# EAGLE design M961 (EAGLE 6.6.0)
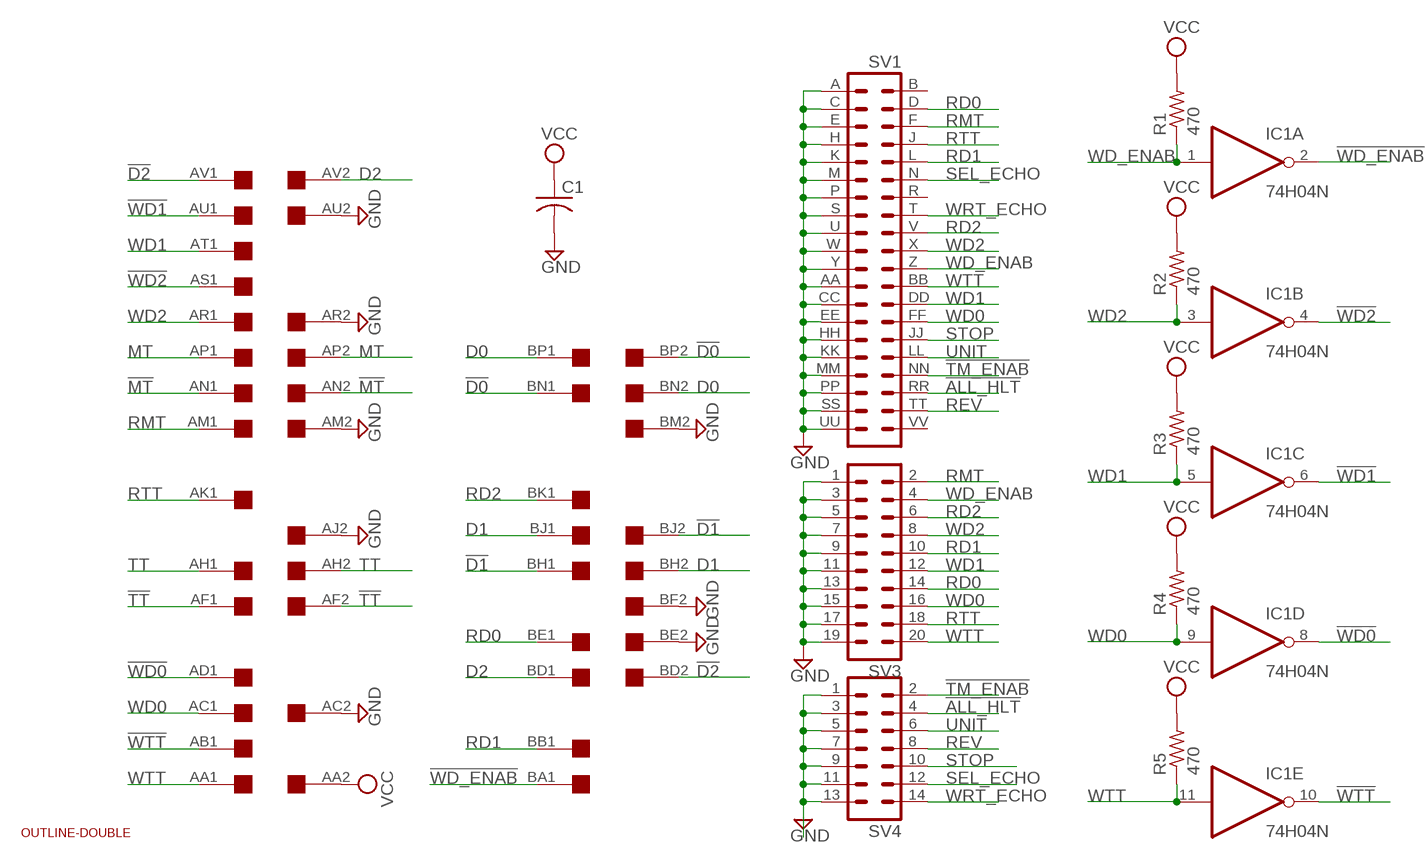
[diagram p0: schematic, sheet 1]

## Parts
C1  C-US050-025X075  [C050-025X075]
EDGE$1  DOUBLE  [EDGE-CON4]
IC1  74H04N  7404N  [DIL14]
R1  470  R-US_0207/10  [0207/10]
R2  470  R-US_0207/10  [0207/10]
R3  470  R-US_0207/10  [0207/10]
R4  470  R-US_0207/10  [0207/10]
R5  470  R-US_0207/10  [0207/10]
SV1  DEC40PINV  [DEC40PINV]
SV3  MA10-2  [MA10-2]
SV4  MA07-2  [MA07-2]
U$2  OUTLINE-DOUBLE  [DOUBLE]

## Nets
!ALL_HLT: SV1.RR SV4.4
!D0: EDGE$1.BN1 EDGE$1.BP2
!D1: EDGE$1.BH1 EDGE$1.BJ2
!D2: EDGE$1.AV1 EDGE$1.BD2
!MT: EDGE$1.AN1 EDGE$1.AN2
!TM_ENAB: SV1.NN SV4.2
!TT: EDGE$1.AF1 EDGE$1.AF2
!WD0: EDGE$1.AD1 IC1.8(D:O)
!WD1: EDGE$1.AU1 IC1.6(C:O)
!WD2: EDGE$1.AS1 IC1.4(B:O)
!WD_ENAB: EDGE$1.BA1 IC1.2(A:O)
!WTT: EDGE$1.AB1 IC1.10(E:O)
D0: EDGE$1.BN2 EDGE$1.BP1
D1: EDGE$1.BH2 EDGE$1.BJ1
D2: EDGE$1.AV2 EDGE$1.BD1
GND: C1.2 EDGE$1.AC2 EDGE$1.AJ2 EDGE$1.AM2 EDGE$1.AR2 EDGE$1.AU2 EDGE$1.BE2 EDGE$1.BF2 EDGE$1.BM2 SV1.A SV1.AA SV1.C SV1.CC SV1.E SV1.EE SV1.H SV1.HH SV1.K SV1.KK SV1.M SV1.MM SV1.P SV1.PP SV1.S SV1.SS SV1.U SV1.UU SV1.W SV1.Y SV3.1 SV3.3 SV3.5 SV3.7 SV3.9 SV3.11 SV3.13 SV3.15 SV3.17 SV3.19 SV4.1 SV4.3 SV4.5 SV4.7 SV4.9 SV4.11 SV4.13
MT: EDGE$1.AP1 EDGE$1.AP2
RD0: EDGE$1.BE1 SV1.D SV3.14
RD1: EDGE$1.BB1 SV1.L SV3.10
RD2: EDGE$1.BK1 SV1.V SV3.6
REV: SV1.TT SV4.8
RMT: EDGE$1.AM1 SV1.F SV3.2
RTT: EDGE$1.AK1 SV1.J SV3.18
SEL_ECHO: SV1.N SV4.12
STOP: SV1.JJ SV4.10
TT: EDGE$1.AH1 EDGE$1.AH2
UNIT: SV1.LL SV4.6
VCC: C1.1 EDGE$1.AA2 R1.2 R2.2 R3.2 R4.2 R5.2
WD0: EDGE$1.AC1 IC1.9(D:I) R4.1 SV1.FF SV3.16
WD1: EDGE$1.AT1 IC1.5(C:I) R3.1 SV1.DD SV3.12
WD2: EDGE$1.AR1 IC1.3(B:I) R2.1 SV1.X SV3.8
WD_ENAB: IC1.1(A:I) R1.1 SV1.Z SV3.4
WRT_ECHO: SV1.T SV4.14
WTT: EDGE$1.AA1 IC1.11(E:I) R5.1 SV1.BB SV3.20
Unconnected: EDGE$1.AB2 EDGE$1.AD2 EDGE$1.AE1 EDGE$1.AE2 EDGE$1.AJ1 EDGE$1.AK2 EDGE$1.AL1 EDGE$1.AL2 EDGE$1.AS2 EDGE$1.AT2 EDGE$1.BA2 EDGE$1.BB2 EDGE$1.BC1 EDGE$1.BC2 EDGE$1.BF1 EDGE$1.BK2 EDGE$1.BL1 EDGE$1.BL2 EDGE$1.BM1 EDGE$1.BR1 EDGE$1.BR2 EDGE$1.BS1 EDGE$1.BS2 EDGE$1.BT1 EDGE$1.BT2 EDGE$1.BU1 EDGE$1.BU2 EDGE$1.BV1 EDGE$1.BV2 IC1.12(F:O) IC1.13(F:I) SV1.B SV1.R SV1.VV

## Power pins joined to a net without a drawn wire
GND: IC1.7(P:GND)
VCC: IC1.14(P:VCC)

## Library data of the parts
C1 = rcl:C-US: CAPACITOR, American symbol
EDGE$1 = dec-con:DOUBLE: Double-Height DEC board
IC1 = 74xx-us:74*04: Hex INVERTER
R1-R5 = rcl:R-US_: RESISTOR, American symbol
SV1 = dec-con:DEC40PIN: PIN HEADER
SV3 = con-lstb:MA10-2: PIN HEADER; OC_FARNELL: unknown; OC_NEWARK: unknown
SV4 = con-lstb:MA07-2: PIN HEADER; OC_FARNELL: unknown; OC_NEWARK: unknown
U$2 = dec-con:OUTLINE-*: Board outlines for DEC boards.

## Board
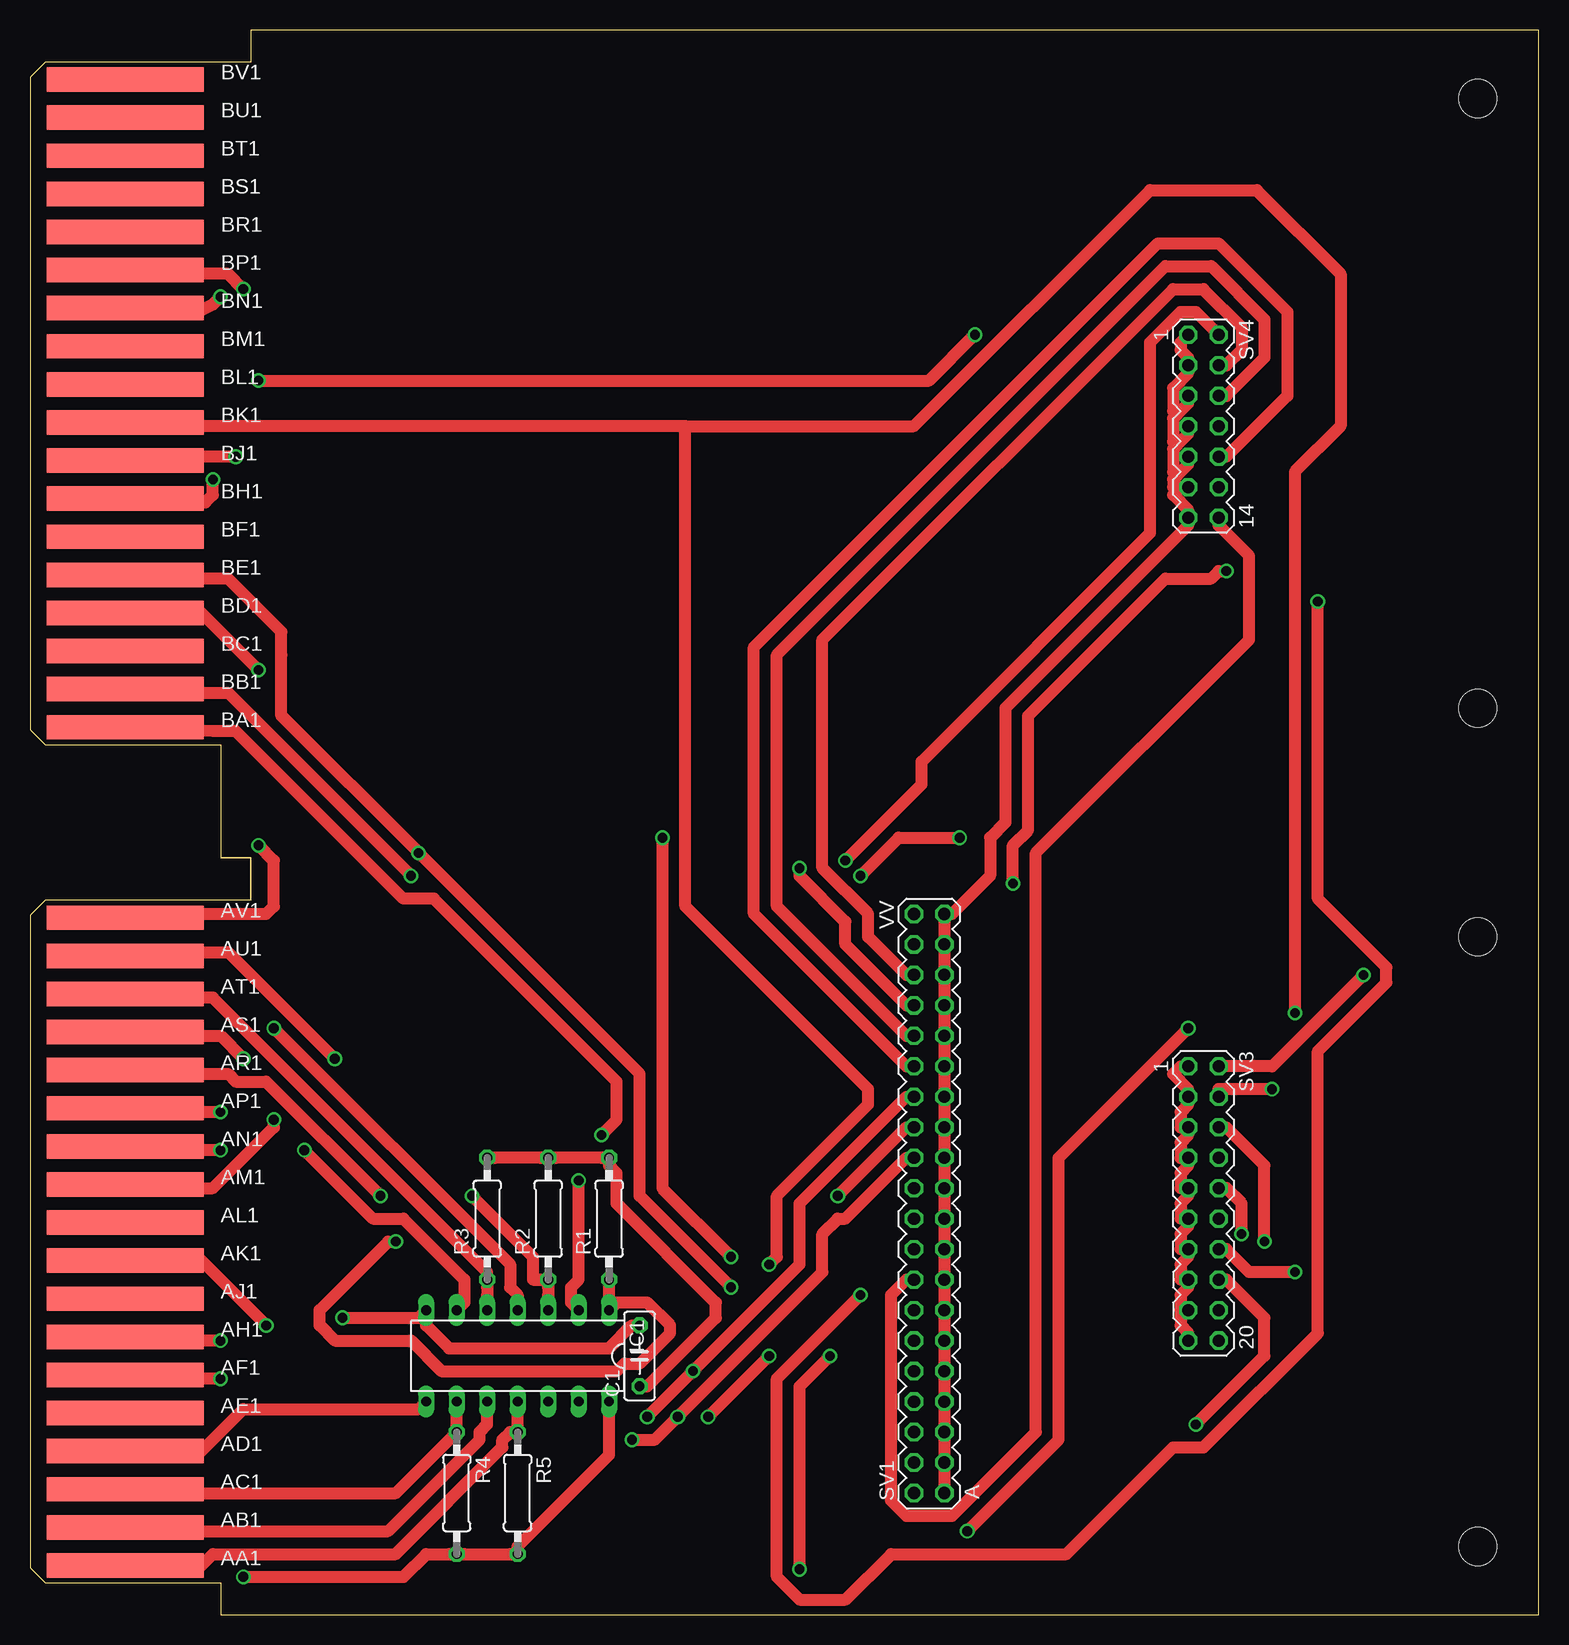
[diagram p1: board, top side]
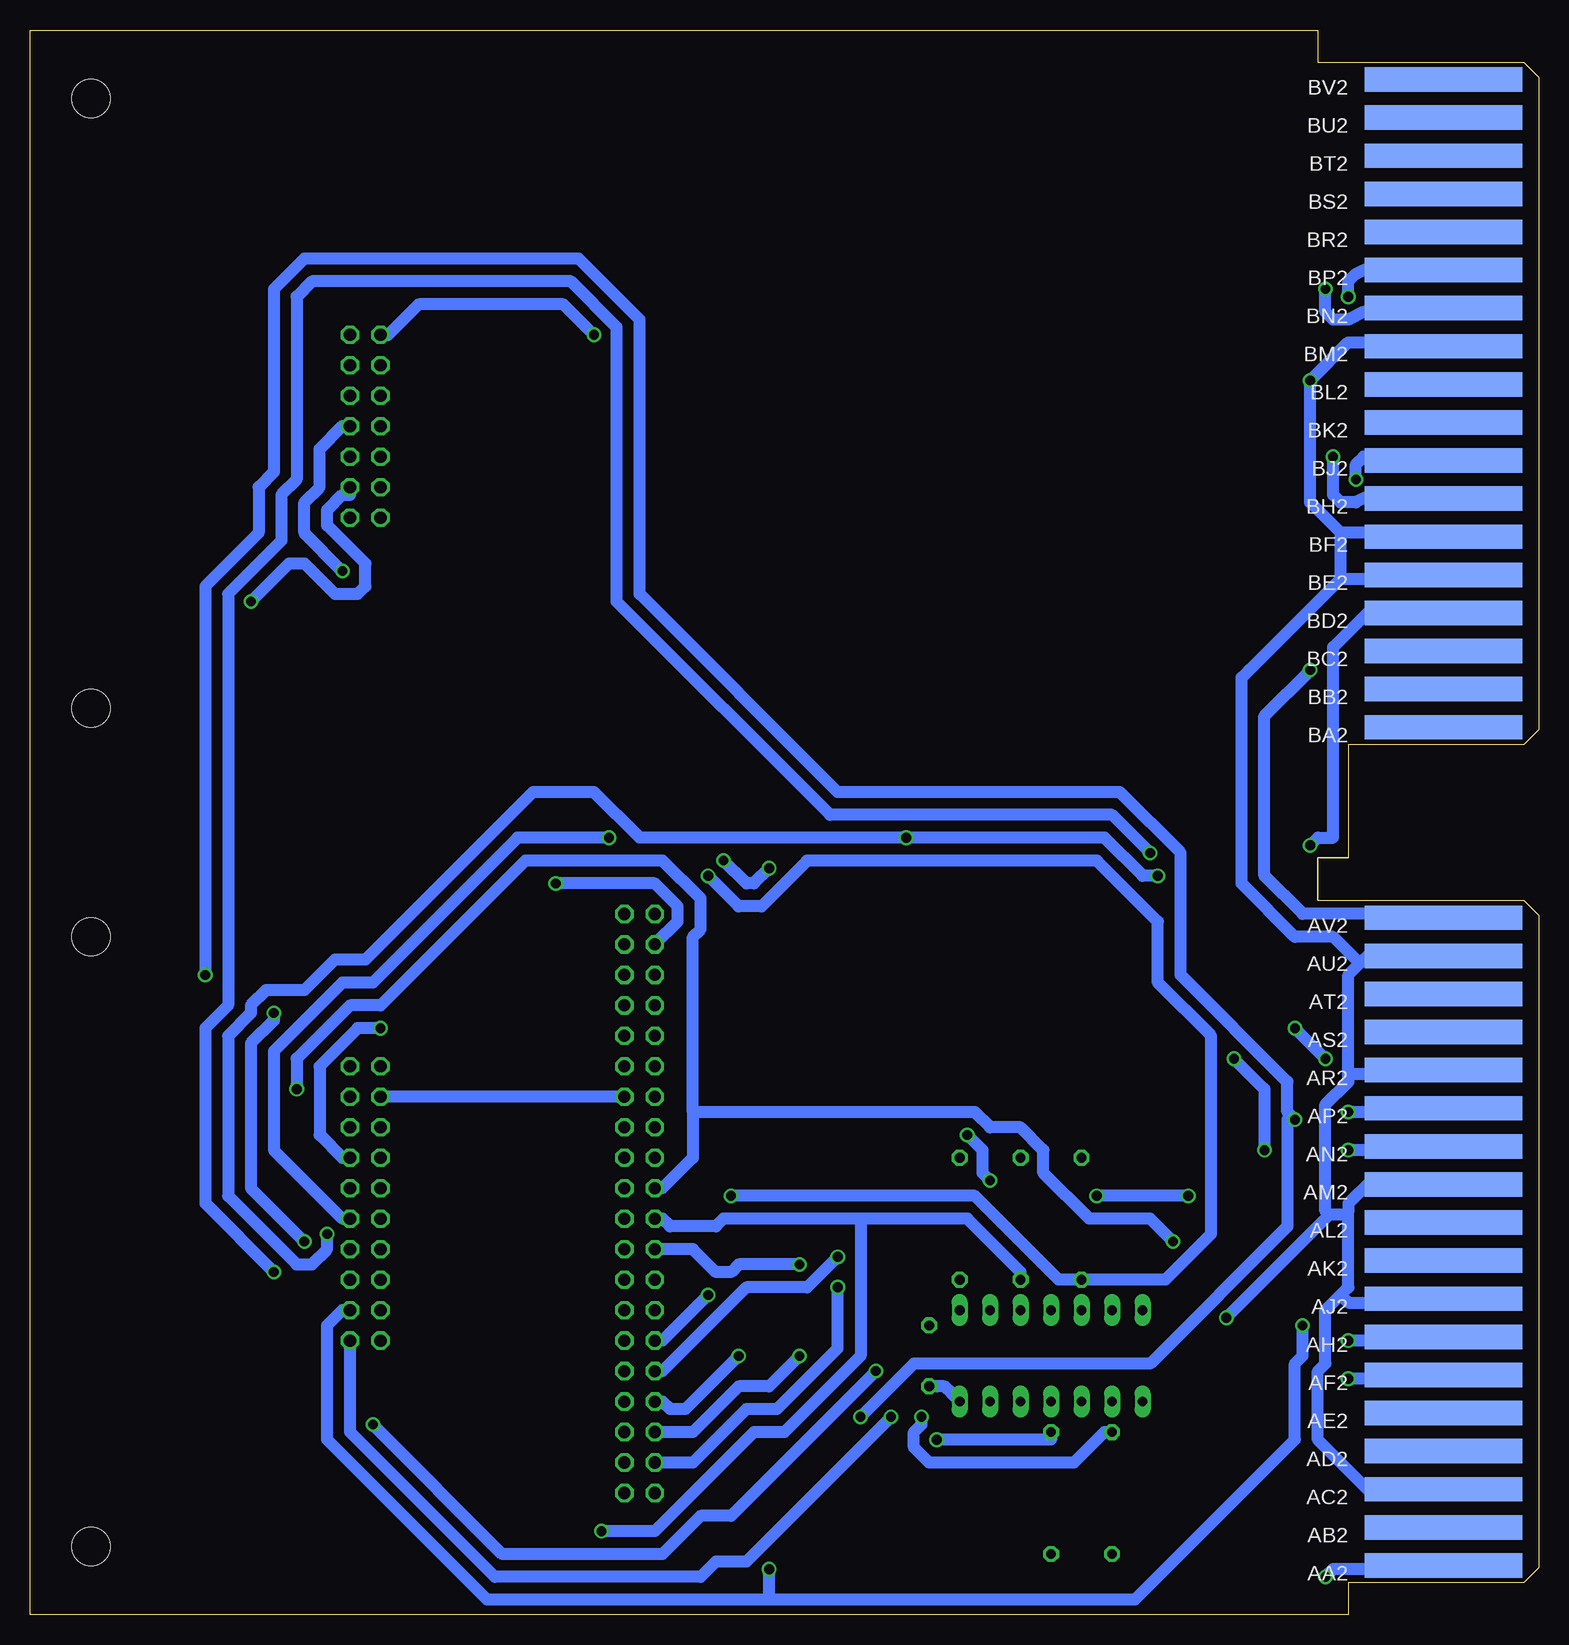
[diagram p2: board, bottom side, seen from below]

Size 125.73 x 132.08 mm. Coordinates in mm from the lower left corner, seen from the top.
Copper layers (1+16): Top 0.035mm / dielectric 1.5mm / Bottom 0.035mm
Design rules "16mils": minimum track width 16mil, minimum drill 32mil, track to track 15mil, track to pad 10mil, pad to pad 10mil, via to via 10mil, smd to smd 10mil, copper to edge 13mil, drill to drill 10mil, minimum pad ring 10mil, minimum via ring 8mil, stop-mask expansion 0mil, vias tented up to drill 0mil, thermal gap 10mil

### Footprints (pad centres in the part's own frame; a part is rotated, then mirrored left to right if it is on the bottom)
C050-025X075 = drill 0.813 octagon: 1 -2.54,0; 2 2.54,0
EDGE-CON4 = smd 13.106 x 2.032: AA1 7.938,4.128; AB1 7.938,7.303; AC1 7.938,10.477; AD1 7.938,13.652; AE1 7.938,16.828; AF1 7.938,20.003; AH1 7.938,23.177; AJ1 7.938,26.352; AK1 7.938,29.527; AL1 7.938,32.703; AM1 7.938,35.877; AN1 7.938,39.053; AP1 7.938,42.227; AR1 7.938,45.403; AS1 7.938,48.578; AT1 7.938,51.752; AU1 7.938,54.928; AV1 7.938,58.102; BA1 7.938,73.978; BB1 7.938,77.153; BC1 7.938,80.328; BD1 7.938,83.502; BE1 7.938,86.677; BF1 7.938,89.853; BH1 7.938,93.028; BJ1 7.938,96.203; BK1 7.938,99.377; BL1 7.938,102.552; BM1 7.938,105.728; BN1 7.938,108.903; BP1 7.938,112.078; BR1 7.938,115.252; BS1 7.938,118.427; BT1 7.938,121.603; BU1 7.938,124.778; BV1 7.938,127.953 | smd 13.106 x 2.032 bottom: AA2 7.938,4.128; AB2 7.938,7.303; AC2 7.938,10.477; AD2 7.938,13.652; AE2 7.938,16.828; AF2 7.938,20.003; AH2 7.938,23.177; AJ2 7.938,26.352; AK2 7.938,29.527; AL2 7.938,32.703; AM2 7.938,35.877; AN2 7.938,39.053; AP2 7.938,42.227; AR2 7.938,45.403; AS2 7.938,48.578; AT2 7.938,51.752; AU2 7.938,54.928; AV2 7.938,58.102; BA2 7.938,73.978; BB2 7.938,77.153; BC2 7.938,80.328; BD2 7.938,83.502; BE2 7.938,86.677; BF2 7.938,89.853; BH2 7.938,93.028; BJ2 7.938,96.203; BK2 7.938,99.377; BL2 7.938,102.552; BM2 7.938,105.728; BN2 7.938,108.903; BP2 7.938,112.078; BR2 7.938,115.252; BS2 7.938,118.427; BT2 7.938,121.603; BU2 7.938,124.778; BV2 7.938,127.953
DIL14 = drill 0.813 long: 1 -7.62,-3.81; 2 -5.08,-3.81; 3 -2.54,-3.81; 4 0,-3.81; 5 2.54,-3.81; 6 5.08,-3.81; 7 7.62,-3.81; 8 7.62,3.81; 9 5.08,3.81; 10 2.54,3.81; 11 0,3.81; 12 -2.54,3.81; 13 -5.08,3.81; 14 -7.62,3.81
0207/10 = drill 0.813 octagon: 1 -5.08,0; 2 5.08,0
DEC40PINV = drill 1.016 octagon: A -24.13,-1.27; AA 3.81,-1.27; B -24.13,1.27; BB 3.81,1.27; C -21.59,-1.27; CC 6.35,-1.27; D -21.59,1.27; DD 6.35,1.27; E -19.05,-1.27; EE 8.89,-1.27; F -19.05,1.27; FF 8.89,1.27; H -16.51,-1.27; HH 11.43,-1.27; J -16.51,1.27; JJ 11.43,1.27; K -13.97,-1.27; KK 13.97,-1.27; L -13.97,1.27; LL 13.97,1.27; M -11.43,-1.27; MM 16.51,-1.27; N -11.43,1.27; NN 16.51,1.27; P -8.89,-1.27; PP 19.05,-1.27; R -8.89,1.27; RR 19.05,1.27; S -6.35,-1.27; SS 21.59,-1.27; T -6.35,1.27; TT 21.59,1.27; U -3.81,-1.27; UU 24.13,-1.27; V -3.81,1.27; VV 24.13,1.27; W -1.27,-1.27; X -1.27,1.27; Y 1.27,-1.27; Z 1.27,1.27
MA10-2 = drill 1.016 octagon: 1 -11.43,-1.27; 2 -11.43,1.27; 3 -8.89,-1.27; 4 -8.89,1.27; 5 -6.35,-1.27; 6 -6.35,1.27; 7 -3.81,-1.27; 8 -3.81,1.27; 9 -1.27,-1.27; 10 -1.27,1.27; 11 1.27,-1.27; 12 1.27,1.27; 13 3.81,-1.27; 14 3.81,1.27; 15 6.35,-1.27; 16 6.35,1.27; 17 8.89,-1.27; 18 8.89,1.27; 19 11.43,-1.27; 20 11.43,1.27
MA07-2 = drill 1.016 octagon: 1 -7.62,-1.27; 2 -7.62,1.27; 3 -5.08,-1.27; 4 -5.08,1.27; 5 -2.54,-1.27; 6 -2.54,1.27; 7 0,-1.27; 8 0,1.27; 9 2.54,-1.27; 10 2.54,1.27; 11 5.08,-1.27; 12 5.08,1.27; 13 7.62,-1.27; 14 7.62,1.27
DOUBLE = hole 3.175: 120.65,56.515; 120.65,5.715; 120.65,75.565; 120.65,126.365

### Placement (x,y rotation side)
C1  50.8,21.59 90 top
EDGE$1  0,0 0 top
IC1  40.64,21.59 180 top
R1  48.26,33.02 90 top
R2  43.18,33.02 90 top
R3  38.1,33.02 90 top
R4  35.56,10.16 270 top
R5  40.64,10.16 270 top
SV1  74.93,34.29 90 top
SV3  97.79,34.29 270 top
SV4  97.79,99.06 270 top
U$2  0,0 0 top

### Tracks (layer width: path | path; a pad name or v marks a point on that pad's centre or on a via)
!ALL_HLT
  Top 1.016: SV1.RR 73.03,53.34 69.85,56.52 69.85,58.42 66.04,62.23 66.04,81.28 95.25,110.49 97.79,110.49 100.97,107.31 100.97,105.41 99.7,104.14 SV4.4
!D0  (via drill 0.81)
  Top 1.016: v15.88,109.86 15.24,109.22 13.97,108.58 EDGE$1.BN1
  Bottom 1.016: v15.88,109.86 15.88,111.12 15.24,111.76 13.97,112.39 EDGE$1.BP2
!D1  (via drill 0.81)
  Top 1.016: v15.24,94.61 15.24,93.34 14.61,92.71 13.97,92.71 EDGE$1.BH1
  Bottom 1.016: v15.24,94.61 15.24,95.89 14.61,96.52 13.97,96.52 EDGE$1.BJ2
!D2  (via drill 0.81)
  Top 1.016: v19.05,64.14 20.32,62.87 20.32,59.05 19.69,58.42 13.97,58.42 EDGE$1.AV1
  Bottom 1.016: v19.05,64.14 18.42,64.77 17.15,64.77 17.15,80.64 13.97,83.82 EDGE$1.BD2
!MT  (via drill 0.81)
  Top 1.016: v15.88,38.73 13.97,38.73 EDGE$1.AN2
  Bottom 1.016: v15.88,38.73 13.97,38.73 EDGE$1.AN2
!TM_ENAB  (via drill 0.81)
  Top 1.016: v64.14,62.23 64.14,61.59 67.95,57.78 67.95,55.88 73.03,50.8 SV1.NN | v67.95,62.87 74.3,69.22 74.3,71.12 93.35,90.17 93.35,106.05 95.89,108.58 97.16,108.58 SV4.2
  Bottom 1.016: v64.14,62.23 65.41,60.96 66.04,60.96 v67.95,62.87
!TT  (via drill 0.81)
  Top 1.016: v15.88,19.68 13.97,19.68 EDGE$1.AF2
  Bottom 1.016: v15.88,19.68 13.97,19.68 EDGE$1.AF2
!WD0
  Top 1.016: IC1.8 32.39,17.14 17.78,17.14 13.97,13.34 EDGE$1.AD1
!WD1  (via drill 0.81)
  Top 1.016: v25.4,46.35 16.51,55.24 13.97,55.24 EDGE$1.AU1 | v22.86,38.73 28.58,33.02 31.12,33.02 36.2,27.94 36.2,26.04 IC1.6
  Bottom 1.016: v25.4,46.35 22.86,43.81 v22.86,38.73
!WD2  (via drill 0.81)
  Top 1.016: v20.32,48.9 40.01,29.21 40.01,27.3 40.64,26.67 IC1.4 | v17.78,46.35 15.88,48.26 13.97,48.26 EDGE$1.AS1
  Bottom 1.016: v17.78,46.35 v20.32,48.9
!WD_ENAB  (via drill 0.81)
  Top 1.016: v47.63,40.01 48.9,41.27 48.9,44.45 33.66,59.69 31.12,59.69 17.15,73.66 15.24,73.66 EDGE$1.BA1 | v45.72,36.2 45.72,27.94 45.09,27.3 45.09,26.04 IC1.2
  Bottom 1.016: v47.63,40.01 46.36,38.73 46.36,36.83 v45.72,36.2
!WTT
  Top 1.016: IC1.10 38.1,15.88 37.47,15.24 37.47,14.61 29.85,6.99 12.7,6.99 EDGE$1.AB1
D0  (via drill 0.81)
  Top 1.016: v17.78,110.49 16.51,111.76 13.97,111.76 EDGE$1.BP1
  Bottom 1.016: v17.78,110.49 17.78,108.58 17.15,107.95 15.88,107.95 14.61,108.58 13.97,108.58 EDGE$1.BN2
D1  (via drill 0.81)
  Top 1.016: v17.15,96.52 13.97,96.52 EDGE$1.BJ1
  Bottom 1.016: v17.15,96.52 17.15,93.34 16.51,92.71 15.24,92.71 13.97,93.34 EDGE$1.BH2
D2  (via drill 0.81)
  Top 1.016: v19.05,78.74 13.97,83.82 EDGE$1.BD1
  Bottom 1.016: v19.05,78.74 22.86,74.93 22.86,61.59 19.69,58.42 13.97,58.42 EDGE$1.AV2
GND  (via drill 0.81)
  Top 1.016: SV3.1 95.89,45.72 95.25,45.09 96.52,43.81 SV3.3 96.52,42.55 95.89,41.91 95.89,40.64 SV3.5 96.52,40.01 95.89,39.37 95.89,38.1 SV3.7 96.52,37.47 95.89,36.83 95.89,35.56 SV3.9 96.52,34.92 95.89,34.29 95.89,33.02 SV3.11 96.52,32.38 95.89,31.75 95.89,30.48 SV3.13 96.52,29.84 95.89,29.21 95.89,27.94 SV3.15 96.52,27.3 95.89,26.67 95.89,25.4 | 95.89,25.4 95.89,24.13 96.52,23.5 SV3.19 | 95.89,25.4 SV3.17 | SV4.1 95.89,106.05 95.89,105.41 96.52,104.78 SV4.3 96.52,103.5 95.25,102.23 95.25,100.33 95.57,100.01 | 95.57,93.66 95.89,93.98 SV4.11 | 95.57,93.66 95.25,93.34 96.52,92.08 SV4.13 96.52,90.81 81.28,75.56 81.28,66.04 80.01,64.77 80.01,61.59 76.84,58.42 SV1.UU SV1.SS SV1.PP SV1.MM SV1.KK SV1.HH SV1.EE SV1.CC SV1.AA SV1.Y SV1.W SV1.U SV1.S SV1.P SV1.M SV1.K SV1.H SV1.E SV1.C SV1.A | 95.57,94.93 95.25,94.61 95.25,93.98 95.57,93.66 | 95.57,94.93 96.52,95.89 SV4.9 | 95.57,97.47 95.25,97.16 95.25,95.25 95.57,94.93 | 95.57,97.47 96.52,98.42 SV4.7 | 95.57,100.01 95.25,99.69 95.25,97.79 95.57,97.47 | 95.57,100.01 96.52,100.97 SV4.5 | C1.2 50.17,24.13 48.26,22.23 34.93,22.23 33.02,24.13 IC1.7 32.39,24.77 v26.04,24.77 | v78.74,106.68 74.93,102.87 v19.05,102.87
  Bottom 0.406: 15.88,45.09 15.88,44.45
  Bottom 1.016: SV1.EE SV3.3 | 16.51,86.36 16.51,90.17 | 16.51,90.17 19.05,92.71 v19.05,102.87 15.88,106.05 13.97,106.05 EDGE$1.BM2 | 16.51,90.17 13.97,90.17 EDGE$1.BF2 | 15.88,45.09 13.97,45.09 EDGE$1.AR2 | 14.92,54.29 13.97,55.24 EDGE$1.AU2 | 14.92,54.29 15.88,53.34 15.88,44.45 17.78,42.55 17.78,33.66 17.46,33.34 | 16.51,26.67 15.88,27.3 15.88,33.66 | 16.51,26.67 15.88,26.04 13.97,26.04 EDGE$1.AJ2 | EDGE$1.AM2 13.97,36.2 15.88,34.29 15.88,33.66 | 15.88,33.66 16.19,33.34 17.46,33.34 | 17.46,33.34 v26.04,24.77 | 16.51,26.67 17.78,25.4 17.78,20.95 18.42,20.32 18.42,14.61 13.97,10.16 12.7,10.16 EDGE$1.AC2 | 16.51,86.36 13.97,86.36 12.7,86.36 EDGE$1.BE2 | 16.51,86.36 24.13,78.74 24.77,78.11 24.77,77.47 24.77,60.96 20.32,56.52 17.15,56.52 14.92,54.29 | v78.74,106.68 81.28,109.22 93.35,109.22 95.89,106.68 SV4.1
MT  (via drill 0.81)
  Top 1.016: v15.88,41.91 13.97,41.91 EDGE$1.AP2
  Bottom 1.016: v15.88,41.91 13.97,41.91 EDGE$1.AP2
RD0  (via drill 0.81)
  Top 1.016: v58.42,27.3 50.8,34.92 50.8,45.09 v32.39,63.5 20.96,74.93 20.96,80.01 20.96,81.92 19.05,83.82 16.51,86.36 13.97,86.36 EDGE$1.BE1 | v105.41,28.57 101.6,28.57 99.7,30.48 SV3.14
  Bottom 1.016: SV1.D 70.49,12.7 66.04,17.14 63.5,17.14 58.42,22.23 v58.42,27.3 | v105.41,28.57 111.13,34.29 111.13,48.9 109.22,50.8 109.22,85.09 104.78,89.53 104.78,93.34 103.51,94.61 103.51,109.86 102.24,111.12 80.65,111.12 76.84,107.31 76.84,84.45 59.06,66.67 35.56,66.67 v32.39,63.5
RD1  (via drill 0.81)
  Top 1.016: v31.75,61.59 16.51,76.83 13.97,76.83 EDGE$1.BB1 | v100.97,31.75 100.97,34.29 99.7,35.56 SV3.10 | v58.42,29.84 52.71,35.56 v52.71,64.77
  Bottom 1.016: v31.75,61.59 33.02,61.59 36.2,64.77 v52.71,64.77 74.93,64.77 78.74,68.58 83.82,68.58 97.79,54.61 100.33,54.61 102.87,52.07 106.05,52.07 107.32,50.8 107.32,50.16 109.22,48.26 109.22,34.92 103.51,29.21 102.24,29.21 100.97,30.48 v100.97,31.75 | v58.42,29.84 60.96,27.3 66.04,27.3 73.03,20.32 SV1.L
RD2  (via drill 0.81)
  Top 1.016: 54.61,99.06 73.66,99.06 93.35,118.75 102.24,118.75 109.22,111.76 109.22,99.06 105.41,95.25 v105.41,50.16 | 54.61,99.06 13.97,99.06 EDGE$1.BK1 | v102.87,31.11 102.87,37.47 99.7,40.64 SV3.6 | v61.6,29.21 62.23,29.84 62.23,34.92 69.85,42.55 69.85,43.81 54.61,59.05 54.61,99.06
  Bottom 1.016: v105.41,50.16 105.41,49.53 107.32,47.62 107.32,35.56 v102.87,31.11 | SV1.V 70.49,30.48 68.58,28.57 67.31,28.57 66.68,29.21 v61.6,29.21
REV  (via drill 0.81)
  Top 1.016: v99.7,87 99.06,87 98.43,86.36 94.62,86.36 83.19,74.93 83.19,65.41 81.92,64.14 v81.92,60.96
  Bottom 1.016: v99.7,87 102.87,90.17 102.87,92.71 101.6,93.98 101.6,97.16 99.7,99.06 SV4.8 | v81.92,60.96 73.66,60.96 71.76,59.05 71.76,57.78 SV1.TT
RMT  (via drill 0.81)
  Top 1.016: v20.32,41.27 20.32,40.64 15.24,35.56 13.97,35.56 EDGE$1.AM1 | v111.13,53.34 103.51,45.72 SV3.2 | v56.52,16.51 v61.6,21.59
  Bottom 1.016: 20.64,41.59 20.96,41.91 20.96,44.45 29.85,53.34 29.85,63.5 34.93,68.58 58.42,68.58 74.93,85.09 74.93,107.95 80.01,113.03 102.87,113.03 105.41,110.49 105.41,95.25 106.68,93.98 106.68,90.17 111.13,85.72 v111.13,53.34 | v20.32,41.27 20.64,41.59 | SV1.F 70.49,15.24 66.68,19.05 64.14,19.05 v61.6,21.59 | v56.52,16.51 52.07,20.95 32.39,20.95 20.96,32.38 20.96,41.27 20.64,41.59
RTT  (via drill 0.81)
  Top 1.016: v19.69,24.13 13.97,29.84 12.7,29.84 EDGE$1.AK1 | v66.68,21.59 64.14,19.05 v64.14,3.81
  Bottom 1.016: v19.69,24.13 19.69,21.59 20.32,20.95 20.32,14.61 33.66,1.27 64.14,1.27 | 64.14,1.27 87.63,1.27 100.97,14.61 100.97,24.13 99.7,25.4 SV3.18 | v66.68,21.59 71.12,17.14 72.39,17.14 73.03,17.78 SV1.J | 64.14,1.27 v64.14,3.81
SEL_ECHO  (via drill 0.81)
  Top 1.016: v107.32,84.45 107.32,59.69 113.03,53.98 113.03,52.7 107.32,46.99 107.32,23.5 97.79,13.97 95.25,13.97 86.36,5.08 71.76,5.08 67.95,1.27 64.14,1.27 62.23,3.17 62.23,19.68 v69.22,26.67
  Bottom 1.016: v107.32,84.45 104.14,87.63 102.87,87.63 100.33,85.09 98.43,85.09 97.79,85.72 97.79,87.63 100.97,90.81 100.97,92.08 99.7,93.34 99.06,93.34 SV4.12 | v69.22,26.67 73.03,22.86 SV1.N
STOP
  Top 1.016: SV1.JJ 73.03,45.72 60.33,58.42 60.33,80.64 93.98,114.3 99.06,114.3 104.78,108.58 104.78,101.6 99.7,96.52 SV4.10
TT  (via drill 0.81)
  Top 1.016: v15.88,22.86 13.97,22.86 EDGE$1.AH2
  Bottom 1.016: v15.88,22.86 13.97,22.86 EDGE$1.AH2
UNIT
  Top 1.016: SV1.LL 73.03,48.26 62.23,59.05 62.23,80.01 94.62,112.39 98.43,112.39 102.87,107.95 102.87,104.78 99.7,101.6 SV4.6
VCC  (via drill 0.81)
  Top 1.016: R3.2 38.74,38.1 42.55,38.1 R2.2 43.82,38.1 47.63,38.1 R1.2 48.26,37.47 48.9,36.83 48.9,34.29 57.15,26.04 57.15,24.77 51.44,19.05 C1.1 | v17.78,3.17 31.12,3.17 33.02,5.08 34.93,5.08 R4.2 36.2,5.08 40.01,5.08 R5.2 40.64,5.71 48.26,13.34 48.26,16.51 IC1.14
  Bottom 1.016: IC1.14 48.9,18.41 49.53,19.05 50.17,19.05 C1.1 | v17.78,3.17 17.15,3.81 13.97,3.81 EDGE$1.AA2
WD0  (via drill 0.81)
  Top 1.016: EDGE$1.AC1 13.97,10.16 30.48,10.16 R4.1 35.56,15.88 35.56,16.51 IC1.9 | v51.44,16.51 v55.25,20.32 64.14,29.21 64.14,34.29 73.03,43.18 SV1.FF | v97.16,15.88 102.87,21.59 102.87,24.77 99.7,27.94 SV3.16
  Bottom 1.016: v51.44,16.51 51.44,15.88 52.07,15.24 52.07,13.97 50.8,12.7 38.74,12.7 36.2,15.24 R4.1 | v97.16,15.88 86.36,5.08 73.03,5.08 69.85,8.26 67.31,8.26 v55.25,20.32
WD1  (via drill 0.81)
  Top 1.016: EDGE$1.AT1 13.97,51.44 15.24,51.44 38.1,28.57 R3.1 38.1,27.3 38.1,26.67 IC1.5 | v67.31,34.92 73.03,40.64 SV1.DD | v77.47,64.77 72.39,64.77 v69.22,61.59
  Bottom 1.016: v67.31,34.92 46.99,34.92 40.01,27.94 38.74,27.94 R3.1 37.47,27.94 31.12,27.94 27.31,31.75 27.31,48.26 31.75,52.7 31.75,57.78 36.83,62.87 60.96,62.87 64.77,59.05 66.68,59.05 v69.22,61.59 | v77.47,64.77 85.09,64.77 97.16,52.7 99.7,52.7 105.41,46.99 105.41,38.73 99.7,33.02 SV3.12
WD2  (via drill 0.81)
  Top 1.016: v29.21,34.92 19.69,44.45 17.15,44.45 16.51,45.09 13.97,45.09 EDGE$1.AR1 | v36.83,34.92 41.91,29.84 41.91,27.94 42.55,27.94 R2.1 43.18,27.3 43.18,26.67 IC1.3 | v96.52,48.9 85.73,38.1 85.73,14.61 v78.11,6.99
  Bottom 1.016: v29.21,34.92 v36.83,34.92 | 56.52,33.02 47.63,33.02 43.18,28.57 R2.1 | 56.52,33.02 67.95,33.02 68.58,32.38 72.39,32.38 73.03,33.02 SV1.X | v96.52,48.9 98.43,48.9 101.6,45.72 101.6,40.01 99.7,38.1 SV3.8 | v78.11,6.99 73.66,6.99 65.41,15.24 62.87,15.24 56.52,21.59 56.52,33.02
WD_ENAB  (via drill 0.81)
  Top 1.016: R1.1 48.26,27.3 48.26,26.67 IC1.1 48.9,26.04 51.44,26.04 53.34,24.13 53.34,23.5 50.8,20.95 49.53,20.95 48.9,20.32 34.29,20.32 31.75,22.86 25.4,22.86 24.13,24.13 24.13,25.4 29.85,31.11 v30.48,31.11 | v103.51,43.81 99.06,43.81 SV3.4
  Bottom 1.016: 70.49,41.91 70.49,56.52 69.85,57.15 69.85,59.69 73.03,62.87 84.46,62.87 96.52,50.8 99.06,50.8 103.51,46.35 v103.51,43.81 | 70.49,41.91 70.49,38.1 73.03,35.56 SV1.Z | v30.48,31.11 32.39,33.02 37.47,33.02 41.28,36.83 41.28,38.73 43.18,40.64 45.72,40.64 46.99,41.91 70.49,41.91
WRT_ECHO
  Top 1.016: SV1.T 73.03,27.94 71.76,26.67 71.76,9.53 73.03,8.26 76.84,8.26 83.82,15.24 83.82,63.5 101.6,81.28 101.6,88.27 99.06,90.81 SV4.14
WTT  (via drill 0.81)
  Top 1.016: EDGE$1.AA1 13.97,3.81 15.24,5.08 30.48,5.08 39.37,13.97 39.37,14.61 40.01,15.24 R5.1 IC1.11 | v50.17,14.61 52.07,14.61 v53.98,16.51 66.04,28.57 66.04,31.75 67.31,33.02 67.95,33.02 73.03,38.1 SV1.BB
  Bottom 1.016: v50.17,14.61 40.64,14.61 R5.1 | SV3.20 99.06,15.24 87,3.17 69.85,3.17 68.58,4.45 66.04,4.45 v53.98,16.51